# Altium schematic sheet S7CAS-PLEIADES-CARTE-MERE_Pxx_POWER.SchDoc
size Tabloid; SheetNumber: 6; SheetTotal: 12; Sheet_Name: POWER FPGA; Size: 11x17
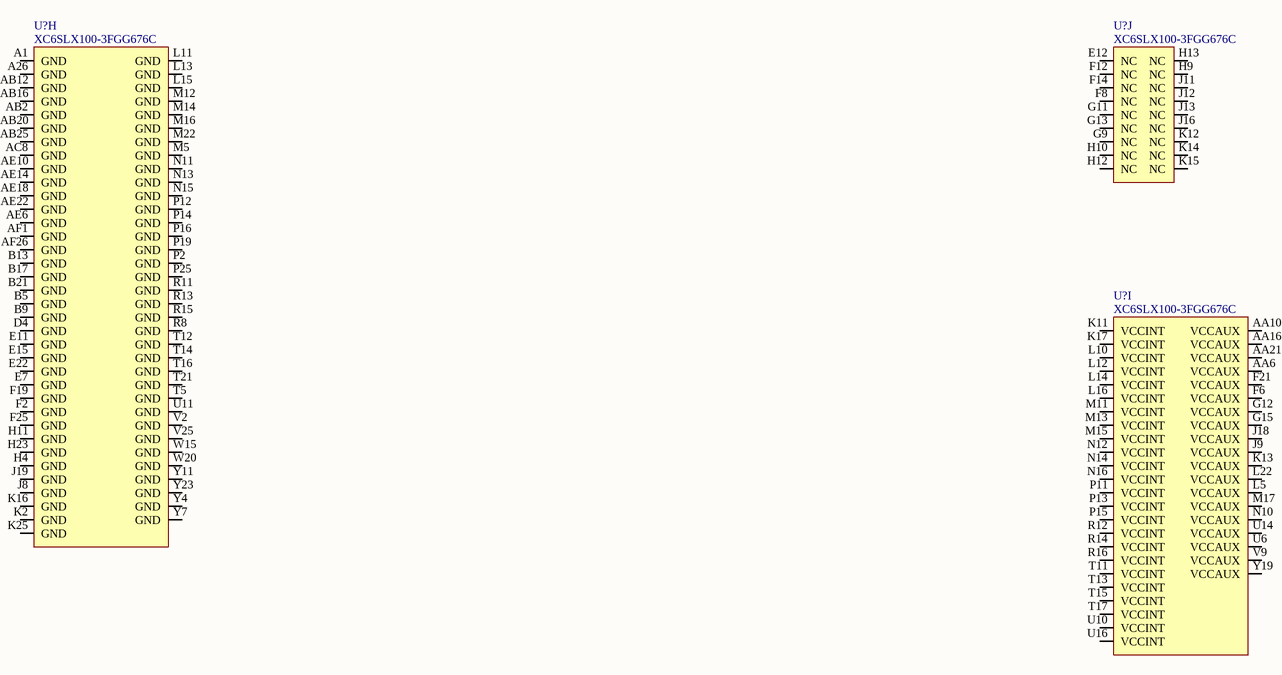
[diagram p0: S7CAS-PLEIADES-CARTE-MERE_Pxx_POWER.SchDoc]

## Parts
(Parts that share a designator on the sheet are numbered #1, #2 ... from top to bottom, then left to right.)
U?#1  XC6SLX100-3FGG676C  [FPGA_XILINX_FGG676]  (part H of 10)
U?#2  XC6SLX100-3FGG676C  [FPGA_XILINX_FGG676]  (part J of 10)
U?#3  XC6SLX100-3FGG676C  [FPGA_XILINX_FGG676]  (part I of 10)

## Nets

Not connected (* = marked no-connect by the designer): U?#1 A1(GND) A26(GND) AB2(GND) AB12(GND) AB16(GND) AB20(GND) AB25(GND) AC8(GND) AE6(GND) AE10(GND) AE14(GND) AE18(GND) AE22(GND) AF1(GND) AF26(GND) B5(GND) B9(GND) B13(GND) B17(GND) B21(GND) D4(GND) E7(GND) E11(GND) E15(GND) E22(GND) F2(GND) F19(GND) F25(GND) H4(GND) H11(GND) H23(GND) J8(GND) J19(GND) K2(GND) K16(GND) K25(GND) L11(GND) L13(GND) L15(GND) M5(GND) M12(GND) M14(GND) M16(GND) M22(GND) N11(GND) N13(GND) N15(GND) P2(GND) P12(GND) P14(GND) P16(GND) P19(GND) P25(GND) R8(GND) R11(GND) R13(GND) R15(GND) T5(GND) T12(GND) T14(GND) T16(GND) T21(GND) U11(GND) V2(GND) V25(GND) W15(GND) W20(GND) Y4(GND) Y7(GND) Y11(GND) Y23(GND); U?#2 E12(NC) F8(NC) F12(NC) F14(NC) G9(NC) G11(NC) G13(NC) H9(NC) H10(NC) H12(NC) H13(NC) J11(NC) J12(NC) J13(NC) J16(NC) K12(NC) K14(NC) K15(NC); U?#3 AA6(VCCAUX) AA10(VCCAUX) AA16(VCCAUX) AA21(VCCAUX) F6(VCCAUX) F21(VCCAUX) G12(VCCAUX) G15(VCCAUX) J9(VCCAUX) J18(VCCAUX) K11(VCCINT) K13(VCCAUX) K17(VCCINT) L5(VCCAUX) L10(VCCINT) L12(VCCINT) L14(VCCINT) L16(VCCINT) L22(VCCAUX) M11(VCCINT) M13(VCCINT) M15(VCCINT) M17(VCCAUX) N10(VCCAUX) N12(VCCINT) N14(VCCINT) N16(VCCINT) P11(VCCINT) P13(VCCINT) P15(VCCINT) R12(VCCINT) R14(VCCINT) R16(VCCINT) T11(VCCINT) T13(VCCINT) T15(VCCINT) T17(VCCINT) U6(VCCAUX) U10(VCCINT) U14(VCCAUX) U16(VCCINT) V9(VCCAUX) Y19(VCCAUX)

## Notes on the sheet
- Sheet Name
- Project Title
- Global Project
- Size
- Group
- Revision
- Date
- Sheet
- of
- Filename
- Designers

## Library data of the parts
U?#1-U?#3 = FPGA_XC6SLX100-3FGG676C: FPGA - XILINX SPARTAN 6 480 I/O - BGA-676; Voltage: 1.14 V ~ 1.26 V; Current: *; Power: *; Mfg: Xilinx; Mfg Part Number: XC6SLX100-3FGG676C; HelpURL: https://www.xilinx.com/support/documentation/data_sheets/ds162.pdf; CreatedBy: Jonathan Bouchard; Temperature: 0°C ~ 85°C (TJ); Value: *; Precision: *; Package: BGA-676; Supplier 1: Digikey; Supplier Part Number 1: 122-1760-ND